# Altium schematic sheet UCC28180-3-V02.SchDoc: Title is Here
size B; Author: Taisen Zhuang; Organization: Altium Limited; Address1: L3, 12a Rodborough Rd; Address2: Frenchs Forest; Address3: NSW; Address4: Australia 2086; DocumentNumber: FMC_Microzed; Revision: B; SheetNumber: 1; SheetTotal: 3
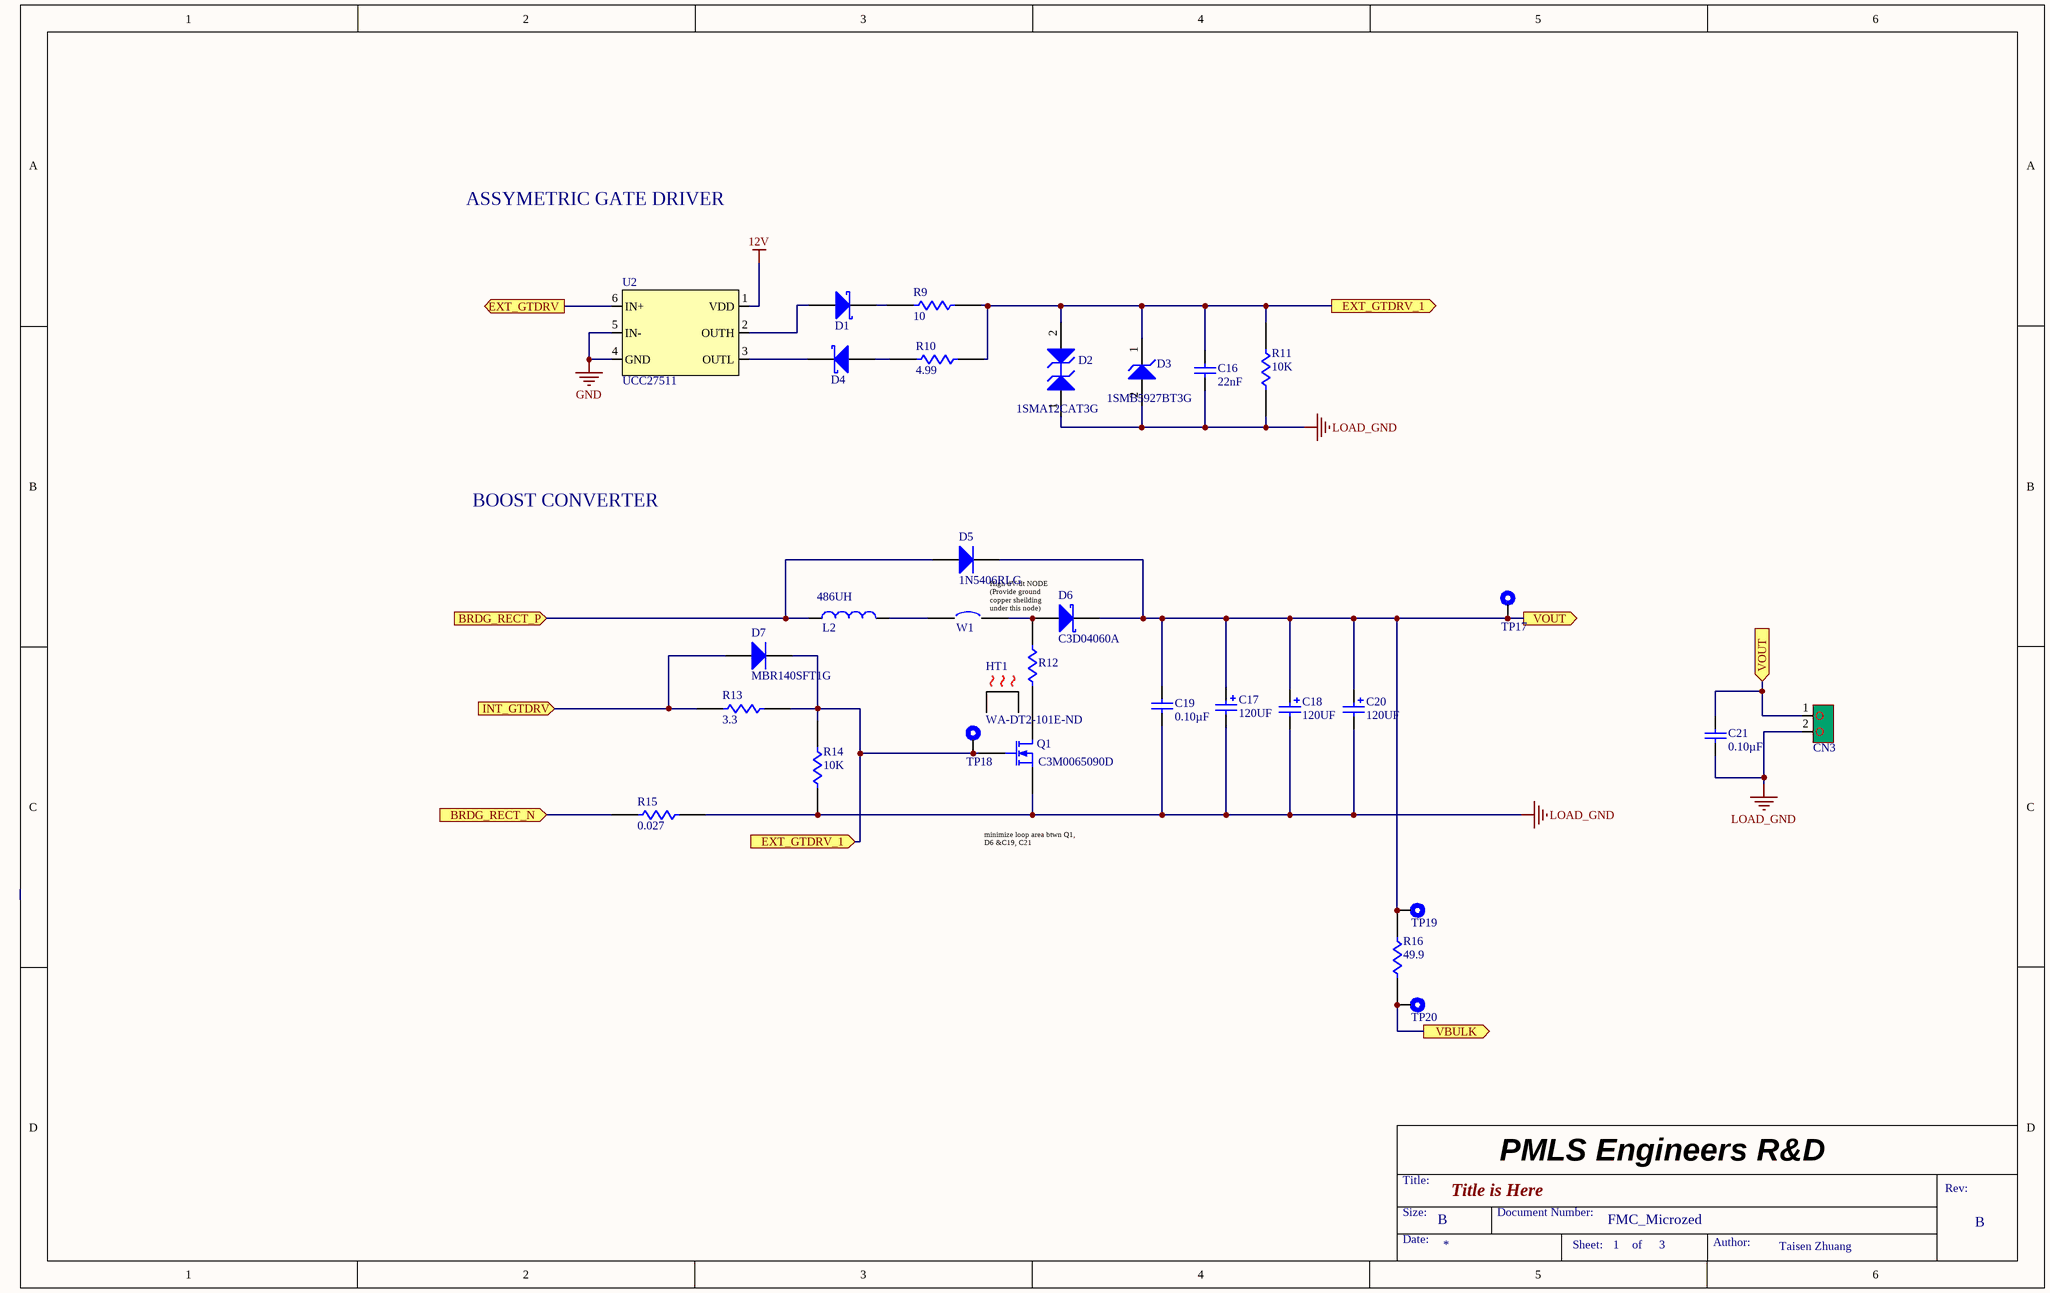
[diagram p0: UCC28180-3-V02.SchDoc]

## Parts
C16  Capacitance: 22nF  [CAP0603]  (hidden comment: C0603C22NF)
C17  Capacitance: 120UF  [450QXW120MEFC18X31.5]  (hidden comment: 450QXW120MEFC18X31.5)
C18  Capacitance: 120UF  [450QXW120MEFC18X31.5]  (hidden comment: 450QXW120MEFC18X31.5)
C19  Capacitance: 0.10µF  [CAP1812]  (hidden comment: GRM43DR72J104KW01L)
C20  Capacitance: 120UF  [450QXW120MEFC18X31.5]  (hidden comment: 450QXW120MEFC18X31.5)
C21  Capacitance: 0.10µF  [CAP1812]  (hidden comment: GRM43DR72J104KW01L)
CN3  1935776  [CONN_1935776]  (value not drawn)
D1  DB2W40300L  [Mini2-F3-B]  (value not drawn)
D2  1SMA12CAT3G  [ONSC-SMA-2-403D-02_F_V]
D3  1SMB5927BT3G  [ONSC-SMB-2-403A-03_H_V]
D4  DB2W40300L  [Mini2-F3-B]  (value not drawn)
D5  1N5406  [1N5406]  (value not drawn)
D6  C3D04060A  [C3D04060A]
D7  MBR140SFT1G  [SODFL360X95-2N]
HT1  WA-DT2-101E-ND  [WA-DT2-101E-ND]
L2  Inductance: 486UH  [XFUSMI4846-HO]  (hidden comment: XFUSMI4846-HO)
Q1  C3M0065090D  [TO-247-3]
R9  Resistance: 10  [RES0805]  (hidden comment: CRCW0805R10)
R10  Resistance: 4.99  [RES0805]  (hidden comment: CRCW0805R4.99)
R11  Resistance: 10K  [RES0603]  (hidden comment: CRCW0603RES10K)
R12  CRCWRSHUNT  [RES2512]  (value not drawn)
R13  Resistance (Ohms): 3.3  [RES1210]  (hidden comment: ERJ-P14J3R3U)
R14  Resistance: 10K  [RES0603]  (hidden comment: CRCW060310K0FKEA)
R15  Resistance: 0.027  [RES2512]  (hidden comment: CRCW2512R0.027)
R16  Resistance (Ohms): 49.9  [RES1206]  (hidden comment: CRCW120649R9FKEA)
TP17  5006  [Test Point]  (value not drawn)
TP18  5006  [Test Point]  (value not drawn)
TP19  5006  [Test Point]  (value not drawn)
TP20  5006  [Test Point]  (value not drawn)
U2  IC name: UCC27511  [SOP6]  (hidden comment: UCC27511DBV)
W1  Wire  [Current Sense Wire]  (value not drawn)

## Ports
BRDG_RECT_N (in), BRDG_RECT_P (in), EXT_GTDRV (out), EXT_GTDRV_1 (in), EXT_GTDRV_1 (out), INT_GTDRV (in), VBULK (out), VOUT (in), VOUT (out)

## Nets
12V: U2.1(VDD)
GND: U2.4(GND) U2.5(IN-)
LOAD_GND: C16.1 C17.2 C18.2 C19.1 C20.2 C21.1 CN3.2 D2.1(A1) D3.2(A) Q1.3(S) R11.2 R14.2 R15.1
BRDG_RECT_N: R15.2 ; port BRDG_RECT_N
BRDG_RECT_P: D5.1(A) L2.1 ; port BRDG_RECT_P
EXT_GTDRV: U2.6(IN+) ; port EXT_GTDRV
EXT_GTDRV_1: C16.2 D2.2(A2) D3.1(K) D7.2 Q1.1(G) R9.1 R10.1 R11.1 R13.1 R14.1 TP18.1 ; port EXT_GTDRV_1
INT_GTDRV: D7.1 R13.2 ; port INT_GTDRV
VBULK: R16.2 TP20.1 ; port VBULK
VOUT: C17.1 C18.1 C19.2 C20.1 C21.2 CN3.1 D5.2(K) D6.1(K) R16.1 TP17.1 TP19.1 ; port VOUT
NetD1_1: D1.1(K) R9.2
NetD1_3: D1.3(A) U2.2(OUTH)
NetD4_1: D4.1(K) U2.3(OUTL)
NetD4_3: D4.3(A) R10.2
NetD6_2: D6.2(A) R12.1 W1.2
NetL2_2: L2.2 W1.1
NetQ1_2: Q1.2(D) R12.2

## Notes on the sheet
- ASSYMETRIC GATE DRIVER
- BOOST CONVERTER
- High dV/dt NODE (Provide ground copper sheilding under this node)
- minimize loop area btwn Q1, D6 &C19, C21
- PMLS Engineers R&D
- Title:
- Size:
- Date:
- B
- Document Number:
- Sheet:
- of
- Author:
- Rev:

## Library data of the parts
C19 C21 = GRM43DR72J104KW01L: CAP CER 0.1UF 630V X7R 1812; Manufacturer 1: Murata Electronics North America; Category 1: Capacitors; Tolerance: ±10%; Supplier 1: Digi-Key; Supplier Part Number 1: 490-3518-1-ND; Manufacturer Part Number 1: GRM43DR72J104KW01L; RoHS 1: RoHS Compliant; Description 1: CAP CER 0.1UF 630V X7R 1812; Stock 1: 99604; Pricing 1: 1=0.84, 10=0.803, 50=0.4796, 100=0.3897, 250=0.32372, 500=0.29376 (USD); Packaging: Cut Tape (CT); Part Status: Active; Voltage - Rated: 630V; Temperature Coefficient: X7R; Operating Temperature: -55°C ~ 125°C; Features: -; Ratings: -; Applications: General Purpose; Mounting Type: Surface Mount, MLCC; Package / Case: 1812 (4532 Metric); Size / Dimension: 0.177" L x 0.126" W (4.50mm x 3.20mm); Height - Seated (Max): -; Thickness (Max): 0.087" (2.20mm); Lead Spacing: -; Lead Style: -; ComponentLink1URL: http://www.murata.com/~/media/webrenewal/support/library/catalog/products/capacitor/mlcc/c02e.pdf; ComponentLink1Description: http://www.murata.com/~/media/webrenewal/support/library/catalog/products/capacitor/mlcc/c02e.pdf
CN3 = 1935776: CONN TERM BLOCK 2POS 5.0MM; Manufacturer 1: Phoenix Contact; Category 1: Connectors, Interconnects; Number of Levels: 1; Positions Per Level: 2; Pitch: 0.197" (5.00mm); Mating Orientation: Horizontal with Board; Current: 20A; Voltage: 300V; Wire Gauge: 12-20 AWG; Wire Termination: Screw; Torque - Screw: 0.45-0.5 Nm (3.9-4.4 Lb-In); Screw Thread: M3; Supplier 1: Digi-Key; Supplier Part Number 1: 277-6405-ND; Manufacturer Part Number 1: 1935776; RoHS 1: RoHS Compliant; Description 1: CONN TERM BLOCK 2POS 5.0MM; Stock 1: 5591; Pricing 1: 1=0.43, 10=0.411, 50=0.3928, 100=0.382, 250=0.357, 500=0.32844, 1000=0.2975 (USD); Packaging: Bulk; Part Status: Active; Mounting Type: Through Hole; Features: Interlocking (Side); Color: Green; Operating Temperature: -; Housing Material: Polyamide (PA), Nylon; Contact Material - Plating: -; Clamp Material - Plating: -; Screw Material - Plating: -; ComponentLink1URL: http://media.digikey.com/pdf/Data%20Sheets/Phoenix%20Contact%20PDFs/COMBICON%20Compact%20PT2,5.pdf; ComponentLink1Description: http://media.digikey.com/pdf/Data%20Sheets/Phoenix%20Contact%20PDFs/COMBICON%20Compact%20PT2,5.pdf
D1 D4 = DB2W40300L: Manufacturer: Panasonic; Diode: DB24403
D2 = 1SMA12CAT3G: 400 W Peak Power Zener Transient Voltage Suppressor, 2-Pin SMA, Pb-Free, Tape and Reel; Manufacturer: On Semiconductor; Direction: Bidirectional; IR Max (uA): 2.5; PPK Max (W): 400; V(BR) Typ (V): 14; DatasheetVersion: Rev. 12; PackageVersion: Rev. F, 11/2008; PackageReference: SMA-2-403D-02_F; PackageDescription: 2-Pin Small Molded Package, J-Bend Lead, Body 2.605 x 4.315 mm; Supplier 1: Digi-Key; Supplier Part Number 1: 1SMA12CAT3GOSTR-ND; Supplier 2: Digi-Key; Supplier Part Number 2: 1SMA12CAT3GOSCT-ND; Supplier 3: Digi-Key; Supplier Part Number 3: 1SMA12CAT3GOSDKR-ND; Supplier 4: Farnell; Supplier Part Number 4: 2369441; Supplier 5: Newark; Supplier Part Number 5: 10N9650; Supplier 6: Mouser; Supplier Part Number 6: 863-1SMA12CAT3G; Packing: Tape and Reel; RoHS: Pb-Free; Mounting Technology: Surface Mount; PartNumber: 1SMA12CAT3G; ComponentLink1Description: Manufacturer URL; ComponentLink1URL: http://www.onsemi.com/; ComponentLink2Description: Datasheet; ComponentLink2URL: http://www.onsemi.com/pub_link/Collateral/1SMA10CAT3-D.PDF; ComponentLink3Description: Package Specification; ComponentLink3URL: http://www.onsemi.com/pub_link/Collateral/1SMA5913BT3-D.PDF
D3 = 1SMB5927BT3G: 3 W Zener Voltage Regulator, 2-Pin SMB, Pb-Free, Tape and Reel; Manufacturer: On Semiconductor; VZ Typ (V): 12; DatasheetVersion: Rev. 8; PackageVersion: Rev. H, 05/2011; PackageReference: SMB-2-403A-03_H; PackageDescription: 2-Pin Small Molded Package, J-Bend Lead, Body 4.33 x 3.625 mm; Supplier 1: Digi-Key; Supplier Part Number 1: 1SMB5927BT3GOSTR-ND; Supplier 2: Digi-Key; Supplier Part Number 2: 1SMB5927BT3GOSCT-ND; Supplier 3: Farnell; Supplier Part Number 3: 1431169RL; Supplier 4: Farnell; Supplier Part Number 4: 1431169; Supplier 5: Farnell; Supplier Part Number 5: 2368211; Supplier 6: Newark; Supplier Part Number 6: 45J2452; Supplier 7: Newark; Supplier Part Number 7: 67R1409; Supplier 8: Mouser; Supplier Part Number 8: 863-1SMB5927BT3G; Packing: Tape and Reel; RoHS: Pb-Free; Mounting Technology: Surface Mount; PartNumber: 1SMB5927BT3G; ComponentLink1Description: Manufacturer URL; ComponentLink1URL: http://www.onsemi.com/; ComponentLink2Description: Datasheet; ComponentLink2URL: http://www.onsemi.com/pub_link/Collateral/1SMB5913BT3-D.PDF; ComponentLink3Description: Package Specification; ComponentLink3URL: http://www.onsemi.com/pub_link/Collateral/1SMB5913BT3-D.PDF
D5 = 1N5406RLG: DIODE GEN PURP 600V 3A DO201AD; Manufacturer: ON Semiconductor; Diode Type: Standard; Voltage - Forward (Vf) (Max) @ If: 1V @ 3A; Speed: Standard Recovery >500ns, > 200mA (Io); Current - Reverse Leakage @ Vr: 10µA @ 600V; Supplier 1: Digi-Key; RoHS: RoHS Compliant; Category: Discrete Semiconductor Products; Stock 1: 14400; Pricing 1: 1200=0.0966, 2400=0.08694, 6000=0.08211, 12000=0.07487, 30000=0.07004, 60000=0.06279 (USD); Packaging: Tape & Reel (TR); Part Status: Active; Capacitance @ Vr, F: -; Mounting Type: Through Hole; Package / Case: DO-201AA, DO-27, Axial; Supplier Device Package: DO-201AD; Operating Temperature - Junction: -65°C ~ 150°C; ComponentLink1URL: http://www.onsemi.com/pub_link/Collateral/1N5400-D.PDF; ComponentLink1Description: http://www.onsemi.com/pub_link/Collateral/1N5400-D.PDF; Supplier Part Number 1: 1N5406RLGOSTR-ND; Manufacturer Part Number: 1N5406RLG
D6 = C3D04060A: DIODE SCHOTTKY 600V 4A TO220-2; Manufacturer 1: Cree/Wolfspeed; Category 1: Discrete Semiconductor Products; Diode Type: Silicon Carbide Schottky; Current - Average Rectified (Io): 4A (DC); Voltage - Forward (Vf) (Max) @ If: 1.8V @ 4A; Speed: No Recovery Time > 500mA (Io); Reverse Recovery Time (trr): 0ns; Current - Reverse Leakage @ Vr: 50µA @ 600V; Capacitance @ Vr, F: 251pF @ 0V, 1MHz; Supplier 1: Digi-Key; Supplier Part Number 1: C3D04060A-ND; RoHS 1: RoHS Compliant; Description 1: DIODE SCHOTTKY 600V 4A TO220-2; Stock 1: 1157; Pricing 1: 1=1.94, 100=1.62, 500=1.39, 1000=1.2125 (USD); Packaging: Tube; Part Status: Active; Voltage - DC Reverse (Vr) (Max): 600V; Mounting Type: Through Hole; Package / Case: TO-220-2; Supplier Device Package: TO-220-2; Operating Temperature - Junction: -55°C ~ 175°C; ComponentLink1URL: http://www.wolfspeed.com/media/downloads/845/C3D04060A.pdf; ComponentLink1Description: http://www.wolfspeed.com/media/downloads/845/C3D04060A.pdf; Manufacturer Part Number 1: C3D04060A
D7 = MBR140SFT1G: DIODE SCHOTTKY 40V 1A SOD123L; Manufacturer: ON Semiconductor; Voltage - Forward (Vf) (Max) @ If: 550mV @ 1A; Speed: Fast Recovery =< 500ns, > 200mA (Io); Current - Reverse Leakage @ Vr: 500µA @ 40V; Supplier 1: Digi-Key; RoHS: RoHS Compliant; Category: Discrete Semiconductor Products; Stock 1: 0; Pricing 1: 3000=0.09129, 6000=0.08622, 15000=0.07861, 30000=0.07354, 75000=0.06593 (USD); Packaging: Tape & Reel (TR); Part Status: Active; Diode Type: Schottky; Voltage - DC Reverse (Vr) (Max): 40V; Current - Average Rectified (Io): 1A; Capacitance @ Vr, F: -; Mounting Type: Surface Mount; Package / Case: SOD-123F; Supplier Device Package: SOD-123L; Operating Temperature - Junction: -55°C ~ 125°C; ComponentLink1URL: http://www.onsemi.com/pub_link/Collateral/MBR140SFT1-D.PDF; ComponentLink1Description: http://www.onsemi.com/pub_link/Collateral/MBR140SFT1-D.PDF; Supplier Part Number 1: MBR140SFT1GOSTR-ND; Manufacturer Part Number: MBR140SFT1G
HT1 = WA-DT2-101E-ND: Manufacturer: Ohmite; Package Cooled: TO-220, TO-247 (Dual); Attachment Method: Clip and PC Pin; Shape: Rectangular, Fins; Power Dissipation @ Temperature Rise: 4W @ 40°C; Thermal Resistance @ Forced Air Flow: 6.0°C/W @ 200 LFM; Thermal Resistance @ Natural: 5°C/W; Material Finish: Black Anodized; Supplier 1: Digi-Key; Manufacturer Part Number: WA-DT2-101E; RoHS: RoHS Compliant; Category: Fans, Thermal Management; Stock 1: 173; Pricing 1: 1=4.43, 10=4.311, 25=4.194, 50=3.961, 100=3.728, 250=3.495, 500=3.3785, 1000=3.029 (USD); Part Status: Active; Type: Board Level, Vertical; Length: 1.200" (30.48mm); Width: 1.710" (43.43mm); Diameter: -; Height Off Base (Height of Fin): 0.630" (16.00mm); Material: Aluminum; ComponentLink1URL: http://media.digikey.com/pdf/Data%20Sheets/Ohmite%20PDFs/W_Series.pdf; ComponentLink1Description: http://media.digikey.com/pdf/Data%20Sheets/Ohmite%20PDFs/W_Series.pdf; Supplier Part Number 1: WA-DT2-101E-ND
Q1 = C3M0065090D: MOSFET N-CH 900V 36A TO247-3; Manufacturer 1: Cree/Wolfspeed; Category 1: Discrete Semiconductor Products; FET Type: N-Channel; Current - Continuous Drain (Id) @ 25°C: 36A (Tc); Drive Voltage (Max Rds On,  Min Rds On): 15V; Vgs(th) (Max) @ Id: 2.1V @ 5mA; Gate Charge (Qg) (Max) @ Vgs: 30.4nC @ 15V; Input Capacitance (Ciss) (Max) @ Vds: 660pF @ 600V; Vgs (Max): +18V, -8V; Power Dissipation (Max): 125W (Tc); Rds On (Max) @ Id, Vgs: 78 mOhm @ 20A, 15V; Supplier 1: Digi-Key; Supplier Part Number 1: C3M0065090D-ND; RoHS 1: RoHS Compliant; Description 1: MOSFET N-CH 900V 36A TO247-3; Stock 1: 4348; Pricing 1: 1=9.98, 100=9.62, 500=9.375 (USD); Packaging: Tube; Part Status: Active; Technology: SiCFET (Silicon Carbide); Drain to Source Voltage (Vdss): 900V; FET Feature: -; Operating Temperature: -55°C ~ 150°C (TJ); Mounting Type: Through Hole; Supplier Device Package: TO-247-3; Package / Case: TO-247-3; ComponentLink1URL: http://www.wolfspeed.com/media/downloads/176/C3M0065090D.pdf; ComponentLink1Description: http://www.wolfspeed.com/media/downloads/176/C3M0065090D.pdf; Manufacturer Part Number 1: C3M0065090D
R13 = ERJ-P14J3R3U: RES SMD 3.3 OHM 5% 1/2W 1210; Manufacturer 1: Panasonic Electronic Components; Category 1: Resistors; Power (Watts): 0.5W, 1/2W; Temperature Coefficient: -100/ +600ppm/°C; Supplier 1: Digi-Key; Supplier Part Number 1: P3.3ASCT-ND; Manufacturer Part Number 1: ERJ-P14J3R3U; RoHS 1: RoHS Compliant; Description 1: RES SMD 3.3 OHM 5% 1/2W 1210; Stock 1: 11138; Pricing 1: 1=0.27, 10=0.226, 25=0.1644, 50=0.1194, 100=0.0885, 250=0.06788, 500=0.05348, 1000=0.03703 (USD); Packaging: Cut Tape (CT); Part Status: Active; Tolerance: ±5%; Composition: Thick Film; Features: Automotive AEC-Q200, Pulse Withstanding; Operating Temperature: -55°C ~ 155°C; Package / Case: 1210 (3225 Metric); Supplier Device Package: 1210; Size / Dimension: 0.126" L x 0.098" W (3.20mm x 2.50mm); Height - Seated (Max): 0.028" (0.70mm); Number of Terminations: 2; Failure Rate: -; ComponentLink1URL: https://industrial.panasonic.com/cdbs/www-data/pdf/RDA0000/AOA0000C243.pdf; ComponentLink1Description: https://industrial.panasonic.com/cdbs/www-data/pdf/RDA0000/AOA0000C243.pdf
R14 = CRCW060310K0FKEA: RES SMD 10K OHM 1% 1/10W 0603; Manufacturer 1: Vishay Dale; Category 1: Resistors; Power (Watts): 0.1W, 1/10W; Temperature Coefficient: ±100ppm/°C; Supplier 1: Digi-Key; Supplier Part Number 1: 541-10.0KHCT-ND; Manufacturer Part Number 1: CRCW060310K0FKEA; RoHS 1: RoHS Compliant; Description 1: RES SMD 10K OHM 1% 1/10W 0603; Stock 1: 4972347; Pricing 1: 1=0.1, 10=0.03, 25=0.022, 50=0.0168, 100=0.0123, 250=0.0094, 500=0.00752, 1000=0.00554 (USD); Packaging: Cut Tape (CT); Part Status: Active; Tolerance: ±1%; Composition: Thick Film; Features: Automotive AEC-Q200; Operating Temperature: -55°C ~ 155°C; Package / Case: 0603 (1608 Metric); Supplier Device Package: 0603; Size / Dimension: 0.063" L x 0.033" W (1.60mm x 0.85mm); Height - Seated (Max): 0.020" (0.50mm); Number of Terminations: 2; Failure Rate: -; ComponentLink1URL: http://www.vishay.com/docs/20035/dcrcwe3.pdf; ComponentLink1Description: http://www.vishay.com/docs/20035/dcrcwe3.pdf
R16 = CRCW120649R9FKEA: RES SMD 49.9 OHM 1% 1/4W 1206; Manufacturer 1: Vishay Dale; Category 1: Resistors; Power (Watts): 0.25W, 1/4W; Temperature Coefficient: ±100ppm/°C; Supplier 1: Digi-Key; Supplier Part Number 1: 541-49.9FCT-ND; Manufacturer Part Number 1: CRCW120649R9FKEA; RoHS 1: RoHS Compliant; Description 1: RES SMD 49.9 OHM 1% 1/4W 1206; Stock 1: 25160; Pricing 1: 1=0.1, 10=0.054, 25=0.0392, 50=0.03, 100=0.0221, 250=0.01684, 500=0.01346, 1000=0.00991 (USD); Packaging: Cut Tape (CT); Part Status: Active; Tolerance: ±1%; Composition: Thick Film; Features: Automotive AEC-Q200; Operating Temperature: -55°C ~ 155°C; Package / Case: 1206 (3216 Metric); Supplier Device Package: 1206; Size / Dimension: 0.126" L x 0.063" W (3.20mm x 1.60mm); Height - Seated (Max): 0.024" (0.60mm); Number of Terminations: 2; Failure Rate: -; ComponentLink1URL: http://www.vishay.com/docs/20035/dcrcwe3.pdf; ComponentLink1Description: http://www.vishay.com/docs/20035/dcrcwe3.pdf
TP17-TP20 = 5006: TEST POINT PC COMPACT .063"D BLK; Manufacturer 1: Keystone Electronics; Category 1: Test and Measurement; Plating: Silver; Material - Insulation: Nylon 46, UL 94V-0; Material - Body: Phosphor Bronze; Supplier 1: Digi-Key; Supplier Part Number 1: 36-5006-ND; Manufacturer Part Number 1: 5006; RoHS 1: RoHS Compliant; Description 1: TEST POINT PC COMPACT .063"D BLK; Stock 1: 199444; Pricing 1: 1=0.37, 10=0.316, 50=0.2298, 100=0.2209, 250=0.19832, 500=0.18932, 1000=0.1616, 2500=0.14424, 5000=0.13523 (USD); Packaging: Bulk; Part Status: Active; Type: PC Test Point, Compact; Mounting Type: 0.063" (1.60mm) Hole Diameter; Color: Black; Size / Dimension: 0.125" Dia x 0.220" L (3.18mm x 5.59mm); ComponentLink1URL: http://www.keyelco.com/product-pdf.cfm?p=1314; ComponentLink1Description: http://www.keyelco.com/product-pdf.cfm?p=1314